# Altium schematic sheet main.SchDoc
size A2
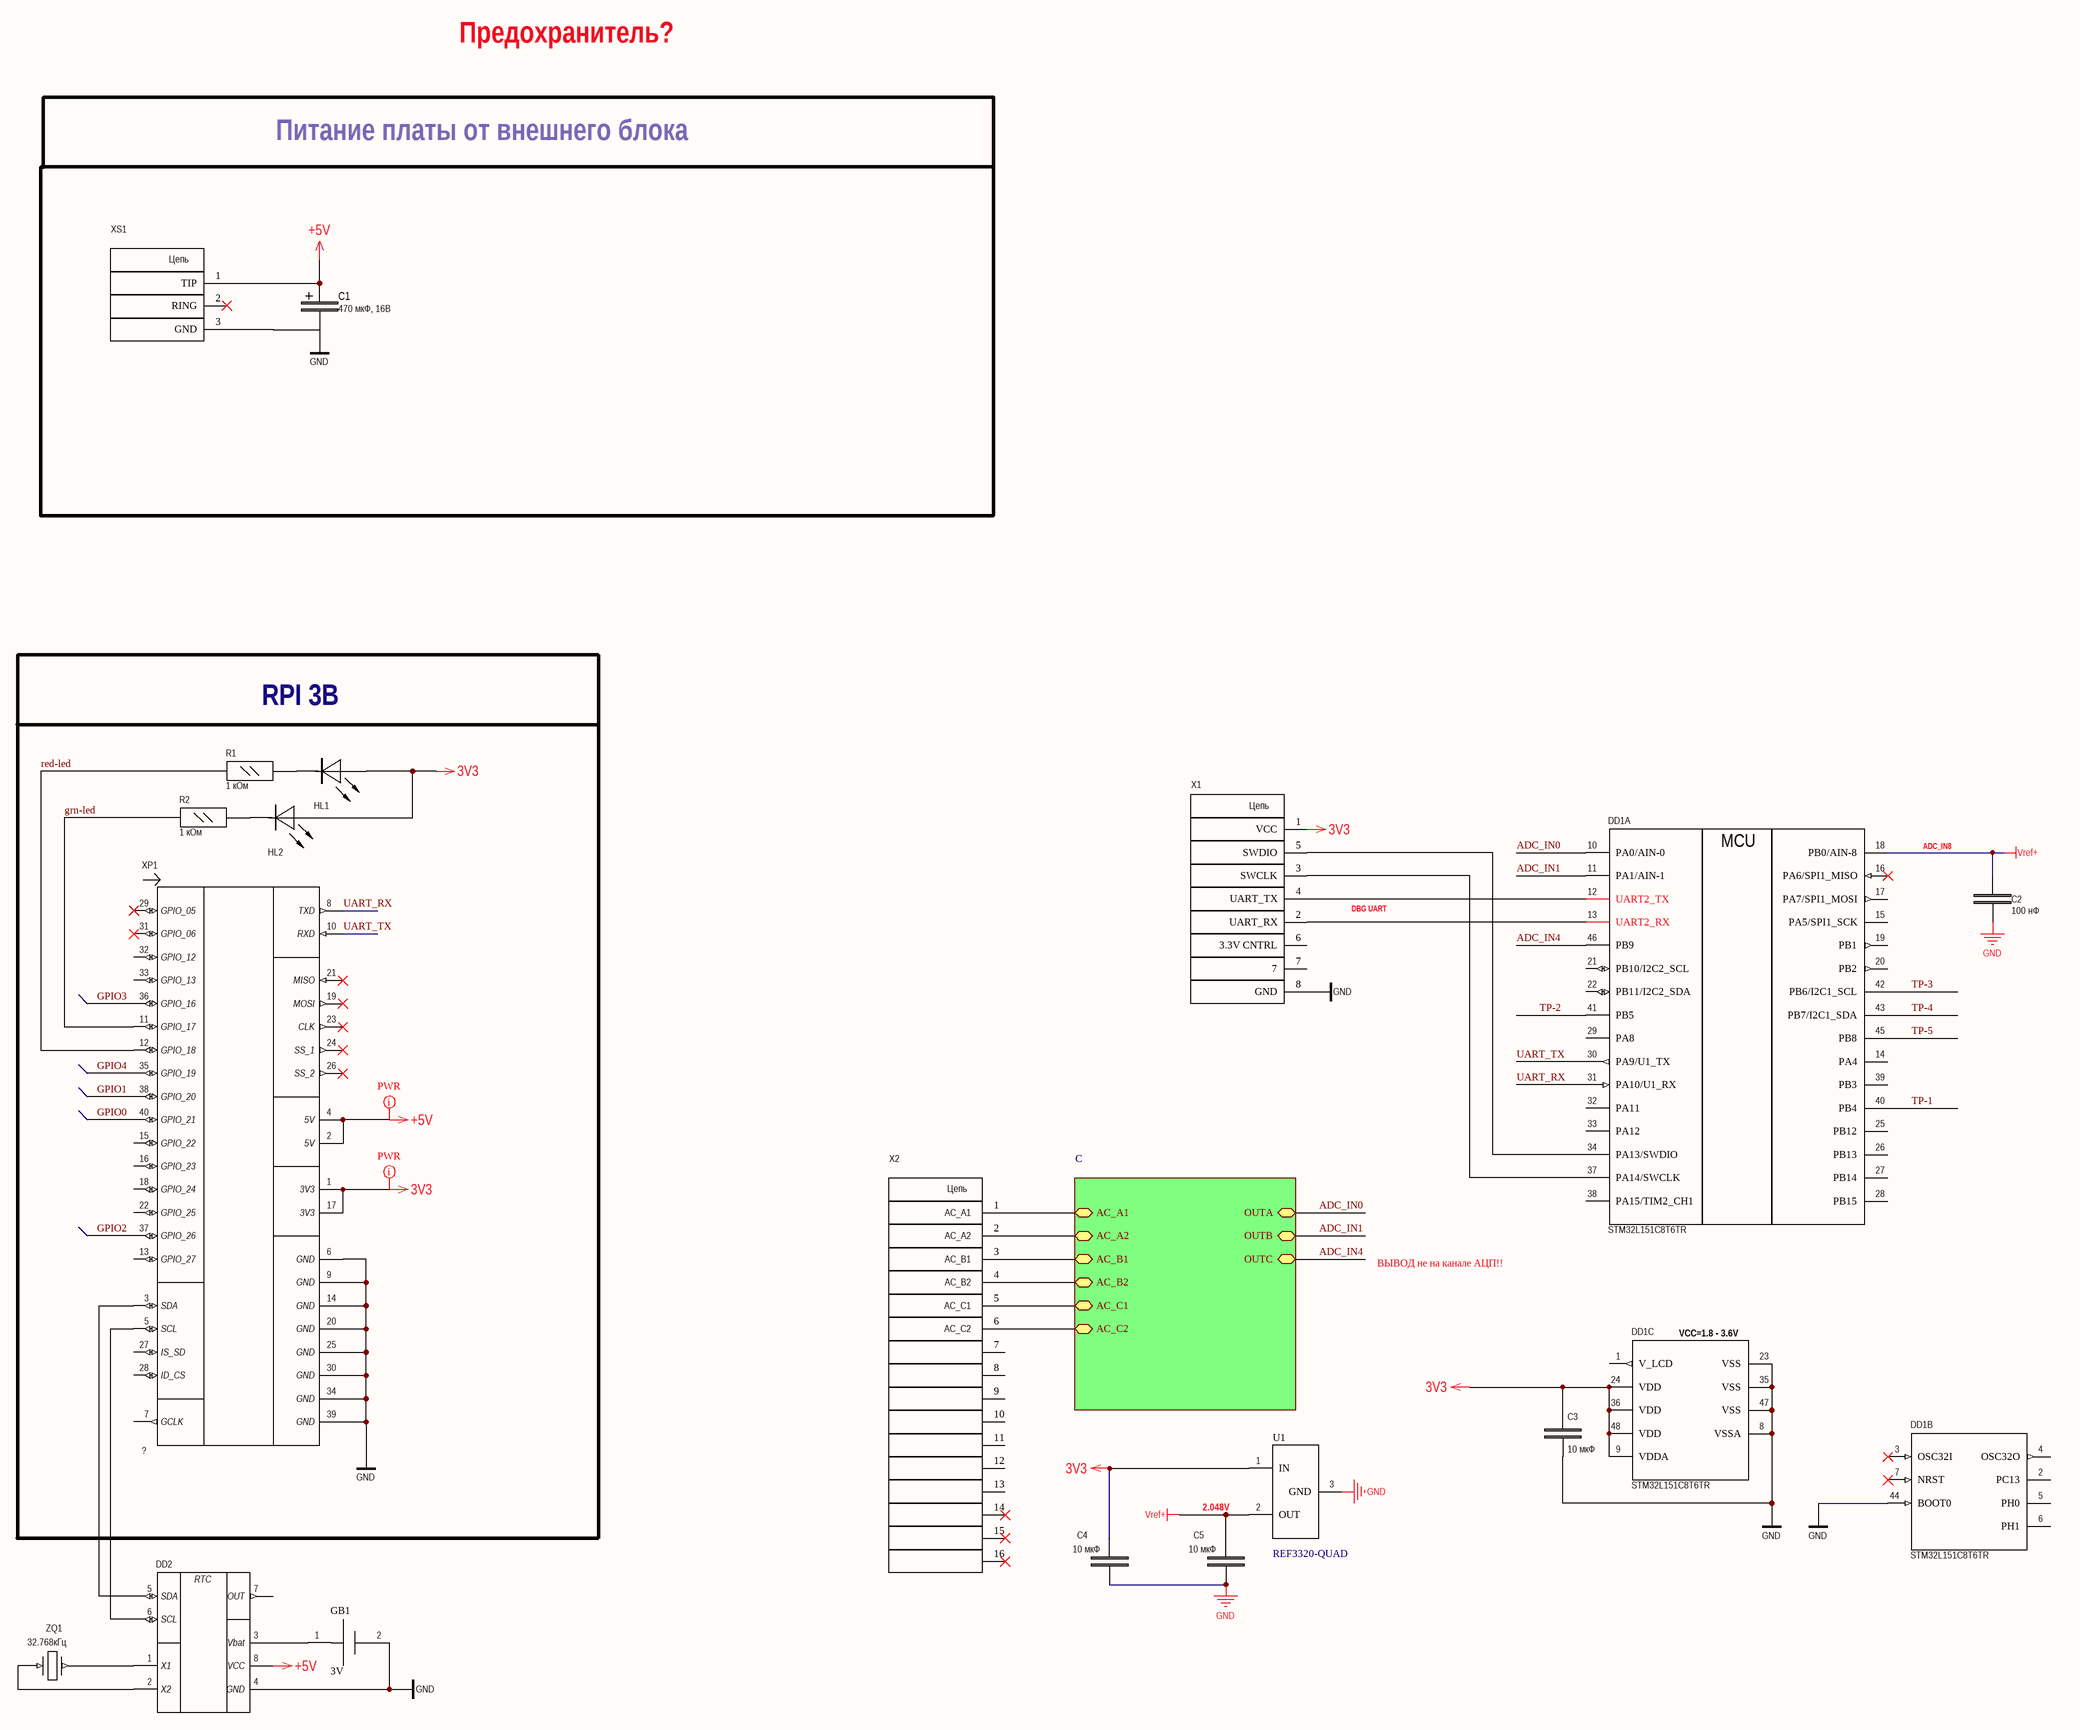
[diagram p0: main.SchDoc]

## Parts
C1  470 мкФ, 16В  [ECAP 10x10.5 SMD]
C2  100 нФ  [CAP0402]
C3  10 мкФ  [CAP0805]
C4  10 мкФ  [CAP0805]
C5  10 мкФ  [CAP0805]
DD1  STM32L151C8T6TR  [LQFP-48]  (parts A,B,C of 3)
DD2  ?  [So-8]  (value not drawn)
GB1  3V  [CRC2032 BAT holder]
HL1  LED  [LED 3MM R RED]  (value not drawn)
HL2  LED  [LED 3MM R GREEN]  (value not drawn)
R1  value 1 кОм  [RES0402]  (hidden comment: RES0805)
R2  value 1 кОм  [RES0402]  (hidden comment: RES0805)
U1  REF3320-QUAD  [SOT-23-3v2]
X1  ?  [PBD-08 - POGO PIN]  (value not drawn)
X2  ?  [microfit30_16]  (value not drawn)
XP1  ?  [PBD-40 2.54 RPI]
XS1  Гнездо питания DS-210  [DS-210]  (value not drawn)
ZQ1  32.768кГц  [Crystal_1_V1]

## Blocks framed on the sheet
RPI 3B: HL1 HL2 R1 R2 XP1

## Sub-sheets
C = current_sensor.SchDoc: AC_A1, AC_A2, AC_B1, AC_B2, AC_C1, AC_C2, OUTA, OUTB, OUTC

## Nets
3V3: C3.2 C4.2 DD1.9(VDDA) DD1.24(VDD) DD1.36(VDD) DD1.48(VDD) HL1.A(Anode) HL2.A(Anode) U1.1(IN) X1.1(VCC) XP1.1(3V3) XP1.17(3V3)
+5V: C1.1 DD2.8(VCC) XP1.2(5V) XP1.4(5V) XS1.1(TIP)
GND: C1.2 C2.1 C3.1 C4.1 C5.1 DD1.8(VSSA) DD1.23(VSS) DD1.35(VSS) DD1.44(BOOT0) DD1.47(VSS) DD2.4(GND) GB1.2(minus) U1.3(GND) X1.8(GND) XP1.6(GND) XP1.9(GND) XP1.14(GND) XP1.20(GND) XP1.25(GND) XP1.30(GND) XP1.34(GND) XP1.39(GND) XS1.3(GND)
Vref+: C2.2 C5.2 DD1.18(PB0/AIN-8) U1.2(OUT)
ADC_IN0: DD1.10(PA0/AIN-0) ; sheet C/OUTA
ADC_IN1: DD1.11(PA1/AIN-1) ; sheet C/OUTB
ADC_IN4: DD1.46(PB9) ; sheet C/OUTC
GPIO0: XP1.40(GPIO_21)
GPIO1: XP1.38(GPIO_20)
GPIO2: XP1.37(GPIO_26)
GPIO3: XP1.36(GPIO_16)
GPIO4: XP1.35(GPIO_19)
grn-led: R2.2 XP1.11(GPIO_17)
red-led: R1.2 XP1.12(GPIO_18)
TP-1: DD1.40(PB4)
TP-2: DD1.41(PB5)
TP-3: DD1.42(PB6/I2C1_SCL)
TP-4: DD1.43(PB7/I2C1_SDA)
TP-5: DD1.45(PB8)
UART_RX: DD1.31(PA10/U1_RX) XP1.8(TXD)
UART_TX: DD1.30(PA9/U1_TX) XP1.10(RXD)
NetDD1_12: DD1.12(UART2_TX) X1.4(UART_TX)
NetDD1_13: DD1.13(UART2_RX) X1.2(UART_RX)
NetDD1_34: DD1.34(PA13/SWDIO) X1.5(SWDIO)
NetDD1_37: DD1.37(PA14/SWCLK) X1.3(SWCLK)
NetDD2_1: DD2.1(X1) ZQ1.1
NetDD2_2: DD2.2(X2) ZQ1.2
NetDD2_3: DD2.3(Vbat) GB1.1(plus)
NetDD2_5: DD2.5(SDA) XP1.3(SDA)
NetDD2_6: DD2.6(SCL) XP1.5(SCL)
NetHL1_C: HL1.C(Cathode) R1.1
NetHL2_C: HL2.C(Cathode) R2.1
NetX2_1: X2.1(AC_A1) ; sheet C/AC_A1
NetX2_2: X2.2(AC_A2) ; sheet C/AC_A2
NetX2_3: X2.3(AC_B1) ; sheet C/AC_B1
NetX2_4: X2.4(AC_B2) ; sheet C/AC_B2
NetX2_5: X2.5(AC_C1) ; sheet C/AC_C1
NetX2_6: X2.6(AC_C2) ; sheet C/AC_C2

Not connected (* = marked no-connect by the designer): DD1 1(V_LCD) 2(PC13) 3(OSC32I)* 4(OSC32O) 5(PH0) 6(PH1) 7(NRST)* 14(PA4) 15(PA5/SPI1_SCK) 16(PA6/SPI1_MISO)* 17(PA7/SPI1_MOSI) 19(PB1) 20(PB2) 21(PB10/I2C2_SCL) 22(PB11/I2C2_SDA) 25(PB12) 26(PB13) 27(PB14) 28(PB15) 29(PA8) 32(PA11) 33(PA12) 38(PA15/TIM2_CH1) 39(PB3); DD2 7(OUT); X1 6(3.3V_CNTRL) 7; X2 7 8 9 10 11 12 13 14* 15* 16*; XP1 7(GCLK) 13(GPIO_27) 15(GPIO_22) 16(GPIO_23) 18(GPIO_24) 19(MOSI)* 21(MISO)* 22(GPIO_25) 23(CLK)* 24(SS_1)* 26(SS_2)* 27(IS_SD) 28(ID_CS) 29(GPIO_05)* 31(GPIO_06)* 32(GPIO_12) 33(GPIO_13); XS1 2(RING)*

## Layout directives
net class Undefined: 3V3, +5V

## Notes on the sheet
- Предохранитель?
- Питание платы от внешнего блока
- ADC_IN8
- DBG UART
- ВЫВОД не на канале АЦП!!
- (near DD1) VCC=1.8 - 3.6V
- 2.048V
- (in symbol DS1307) RTC
- (in symbol IDC-16-MR) Цепь
- (in symbol STM32L151C8T6TR, part A) MCU
- (in symbol Гнездо питания DC005 5.5x2.5) Цепь
- (in symbol Разьем_8_под_pogopin) Цепь

## Library data of the parts
C1 = Конденсатор_полярный: value: 470 мкФ, 16В
C2 C3 = CAP0805: Конденсатор
  C2: value: 100 нФ; price: 0.1
  C3: value: 10 мкФ; price: 1
C4 C5 = CAP0805: value: 10 мкФ; price: 0.1
DD1 = STM32L151C8T6TR: Микроконтроллер; Value: *; price: 107
DD2 = DS1307: I2C Real-Time Clock; type: ?; value: ?
GB1 = CRC2032 Bat holder
HL1 = LED: Светодиод зеленый; Type: ?; value: ?; price: 1.5
HL2 = LED: Светодиод красный; Type: ?; value: ?; price: 1.5
R1 R2 = RES0805: Резистор 0805; price: 0.1
U1 = REF3333-QUAD: PCB: SOT-23; vref: 2.048V; partid: REF3320; link: https://www.aliexpress.com/item/Free-Shipping-REF3320AIDCKR-REF3320AIDCKT-REF3320-R20/32890922006.html?spm=2114.search0604.3.1.52933561mvZQ8T&ws_ab_test=searchweb0_0,searchweb201602_1_10065_10068_319_317_10696_453_10084_454_10083_10618_10307_10301_537_536_10902_10059_10884_10889_10887_321_322_10915_10103_10914_10911_10910,searchweb201603_51,ppcSwitch_0&algo_expid=3bee8939-0ad4-47b9-8e08-02eb205603b1-0&algo_pvid=3bee8939-0ad4-47b9-8e08-02eb205603b1&transAbTest=ae803_3
X1 = Разьем_8_под_pogopin: Type: ?; value: ?
X2 = IDC-16-MR: Type: ?; value: ?
XP1 = Raspberry Pi 3 Header: Type: ?; value: ?
XS1 = Гнездо питания DC005 5.5x2.5: 2.5x5.5мм
ZQ1 = 32.768 кГц: Кварцевый резонатор; Type: ?; value: 32.768кГц; price: 6